# EAGLE design VIA_PAR_Adapter_Low (EAGLE 9.5.2)
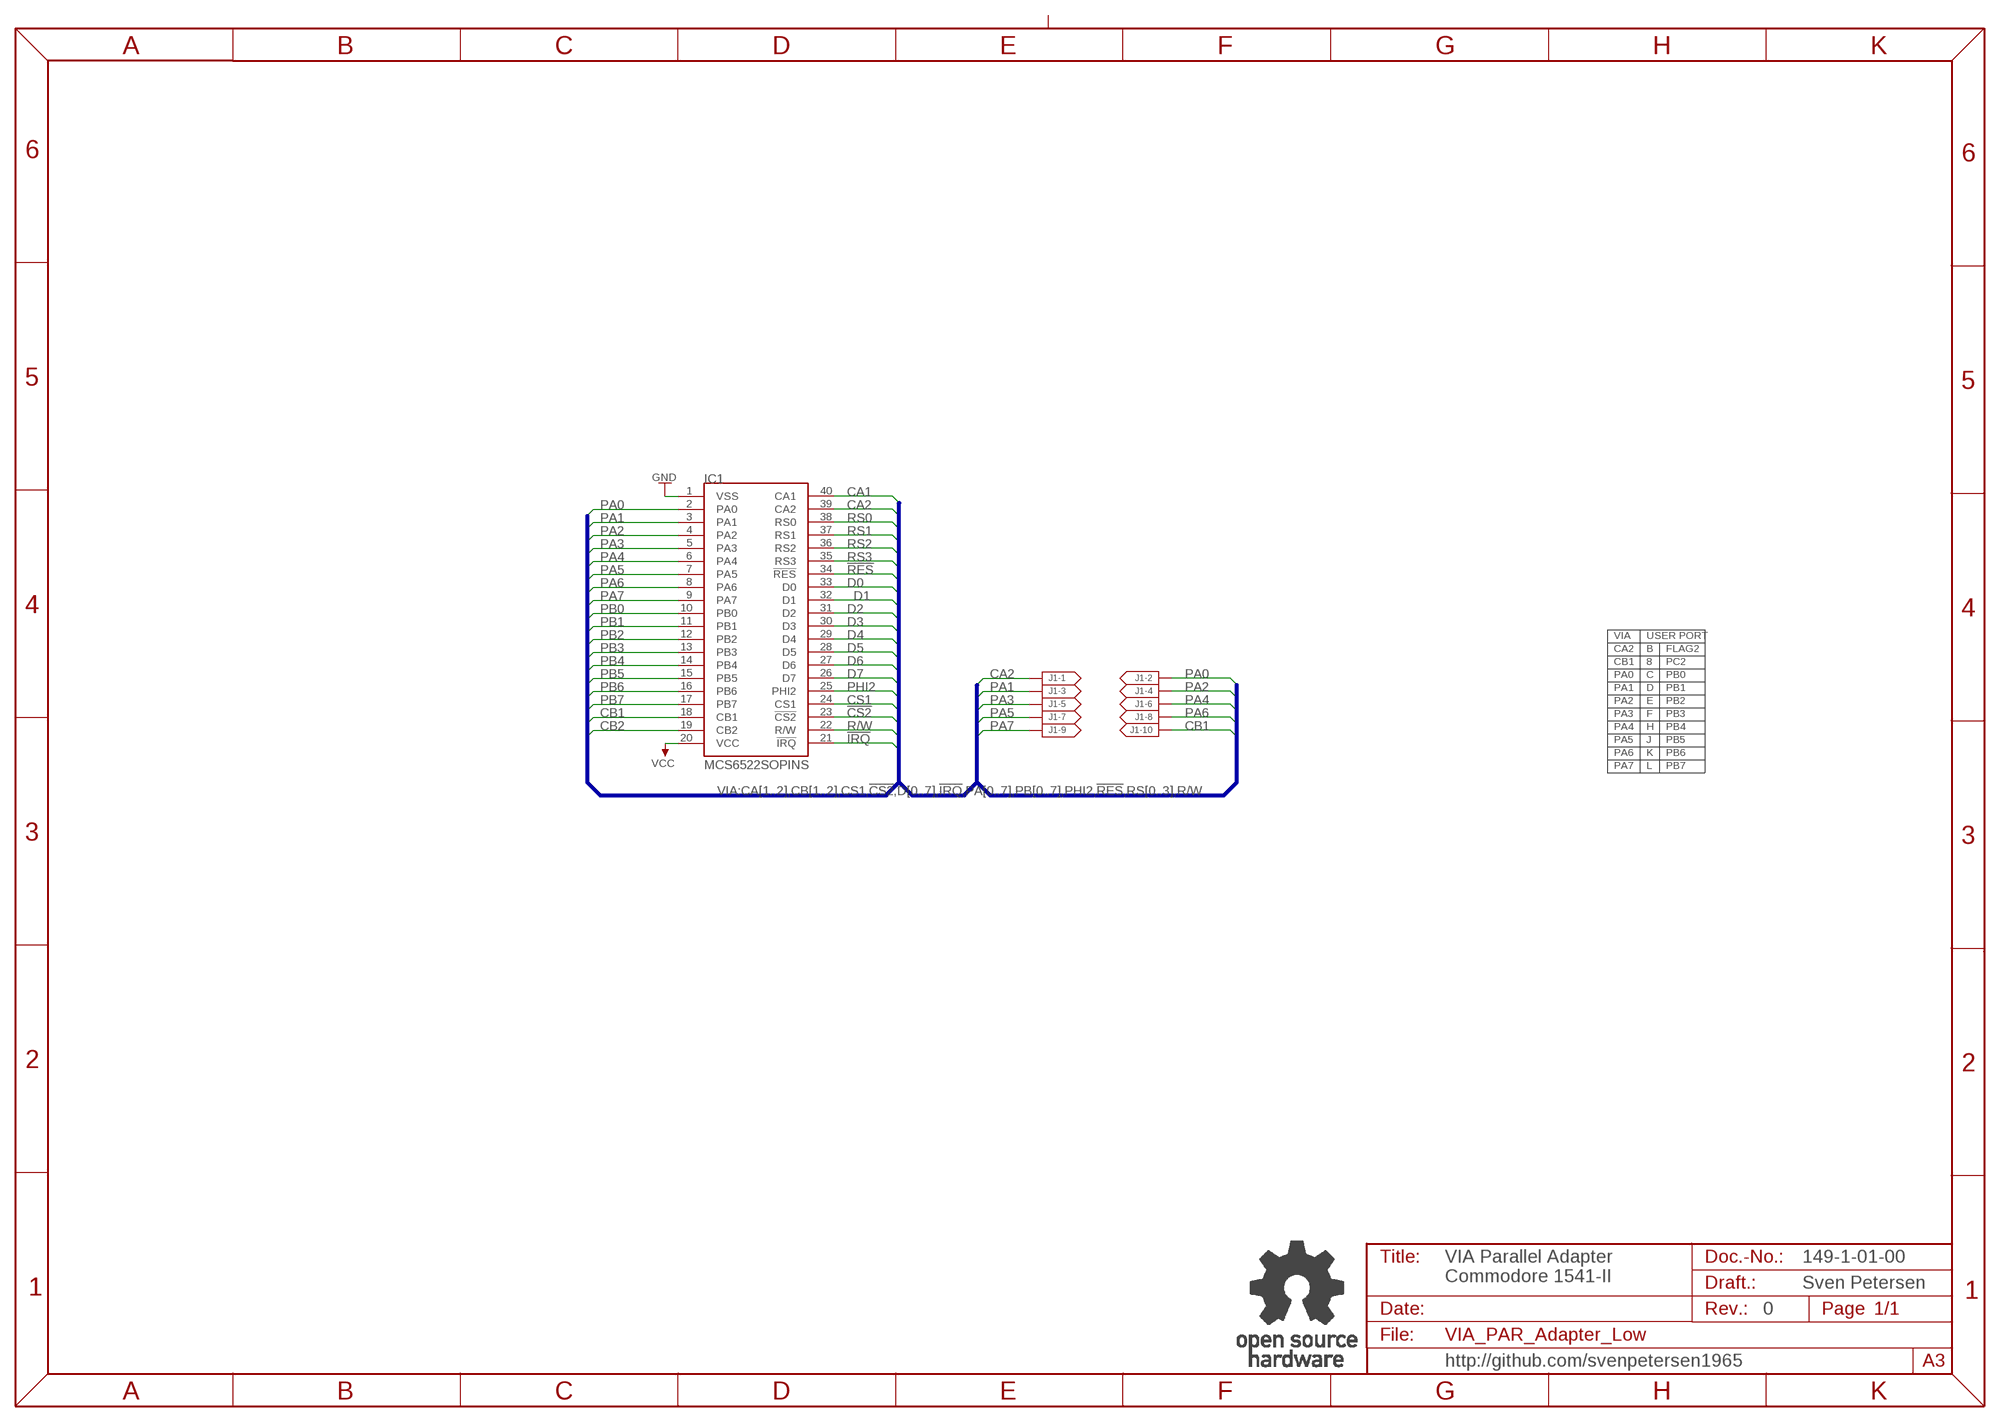
[diagram p0: schematic, sheet 1]

## Parts
IC1  MCS6522SOPINS  [SOCKETPINS40]
J1  MICMA10B-THT  [MICMA10B]
U$5  OPEN_SOURCE_HW  [OPENHW]

## Nets
!CS2: IC1.23(!CS2)
!IRQ: IC1.21(!IRQ)
!RES: IC1.34(!RES)
CA1: IC1.40(CA1)
CA2: IC1.39(CA2) J1.1
CB1: IC1.18(CB1) J1.10
CB2: IC1.19(CB2)
CS1: IC1.24(CS1)
D0: IC1.33(D0)
D1: IC1.32(D1)
D2: IC1.31(D2)
D3: IC1.30(D3)
D4: IC1.29(D4)
D5: IC1.28(D5)
D6: IC1.27(D6)
D7: IC1.26(D7)
GND: IC1.1(VSS)
PA0: IC1.2(PA0) J1.2
PA1: IC1.3(PA1) J1.3
PA2: IC1.4(PA2) J1.4
PA3: IC1.5(PA3) J1.5
PA4: IC1.6(PA4) J1.6
PA5: IC1.7(PA5) J1.7
PA6: IC1.8(PA6) J1.8
PA7: IC1.9(PA7) J1.9
PB0: IC1.10(PB0)
PB1: IC1.11(PB1)
PB2: IC1.12(PB2)
PB3: IC1.13(PB3)
PB4: IC1.14(PB4)
PB5: IC1.15(PB5)
PB6: IC1.16(PB6)
PB7: IC1.17(PB7)
PHI2: IC1.25(PHI2)
R/W: IC1.22(R/W)
RS0: IC1.38(RS0)
RS1: IC1.37(RS1)
RS2: IC1.36(RS2)
RS3: IC1.35(RS3)
VCC: IC1.20(VCC)

## Buses
VIA:CA[1..2],CB[1..2],CS1,!CS2,D[0..7],!IRQ,PA[0..7],PB[0..7],PHI2,!RES,RS[0..3],R/W

## Notes on the sheet
- VIA | USER PORT
- CA2 | B | !FLAG2
- CB1 | 8 | !PC2
- PA0 | C | PB0
- PA1 | D | PB1
- PA2 | E | PB2
- PA3 | F | PB3
- PA4 | H | PB4
- PA5 | J | PB5
- PA6 | K | PB6
- PA7 | L | PB7
- 149-1-01-00
- VIA Parallel Adapter
  Commodore 1541-II
- Sven Petersen
- 0
- http://github.com/svenpetersen1965

## Library data of the parts
IC1 = MOS:MCS6522
J1 = AMP:MICMA10B
U$5 = Logo:OPEN_SOURCE_HW

## Board
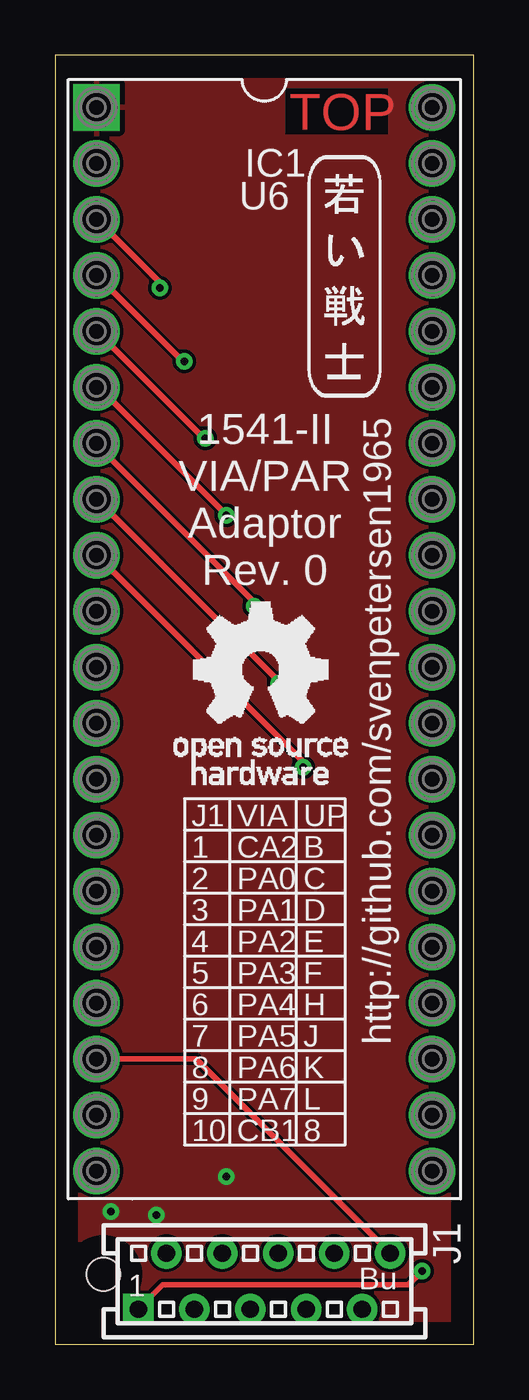
[diagram p1: board, top side]
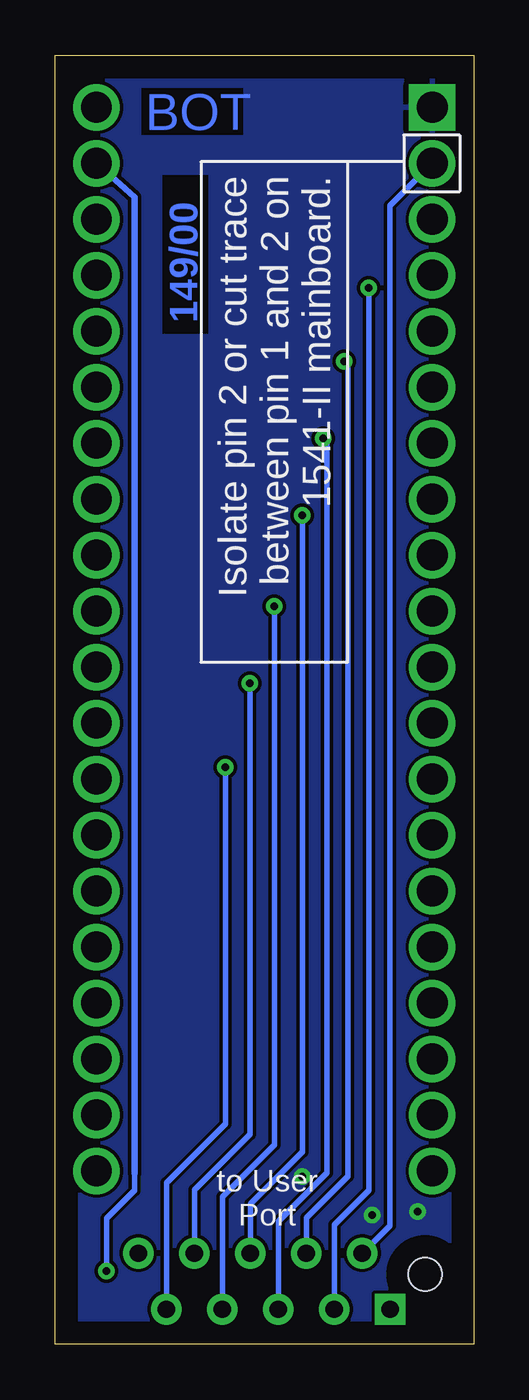
[diagram p2: board, bottom side, seen from below]

Size 19 x 58.5 mm. Coordinates in mm from the lower left corner, seen from the top.
Outline: 0,0 19,0 19,58.5 0,58.5 0,0
Copper layers (1*16): Top 0.035mm / dielectric 1.5mm / Bottom 0.035mm
Design rules "default *": minimum track width 6mil, minimum drill 0.35mm, track to track 6mil, track to pad 6mil, pad to pad 6mil, via to via 6mil, smd to smd 6mil, copper to edge 40mil, drill to drill 6mil, minimum pad ring 10mil, minimum via ring 8mil, stop-mask expansion 4mil, vias tented up to drill 25mil, thermal gap 10mil
bRestrict: 4 lines

### Footprints (pad centres in the part's own frame; a part is rotated, then mirrored left to right if it is on the bottom)
SOCKETPINS40 = drill 1.4 square: 1 -24.13,-7.62 | drill 1.4: 2 -21.59,-7.62; 3 -19.05,-7.62; 4 -16.51,-7.62; 5 -13.97,-7.62; 6 -11.43,-7.62; 7 -8.89,-7.62; 8 -6.35,-7.62; 9 -3.81,-7.62; 10 -1.27,-7.62; 11 1.27,-7.62; 12 3.81,-7.62; 13 6.35,-7.62; 14 8.89,-7.62; 15 11.43,-7.62; 16 13.97,-7.62; 17 16.51,-7.62; 18 19.05,-7.62; 19 21.59,-7.62; 20 24.13,-7.62; 21 24.13,7.62; 22 21.59,7.62; 23 19.05,7.62; 24 16.51,7.62; 25 13.97,7.62; 26 11.43,7.62; 27 8.89,7.62; 28 6.35,7.62; 29 3.81,7.62; 30 1.27,7.62; 31 -1.27,7.62; 32 -3.81,7.62; 33 -6.35,7.62; 34 -8.89,7.62; 35 -11.43,7.62; 36 -13.97,7.62; 37 -16.51,7.62; 38 -19.05,7.62; 39 -21.59,7.62; 40 -24.13,7.62
MICMA10B = drill 0.787 pad 1.397 square: 1 5.715,1.27 | drill 0.787 pad 1.397: 2 4.445,-1.27; 3 3.175,1.27; 4 1.905,-1.27; 5 0.635,1.27; 6 -0.635,-1.27; 7 -1.905,1.27; 8 -3.175,-1.27; 9 -4.445,1.27; 10 -5.715,-1.27 | hole 1.499: 7.303,-0.318

### Placement (x,y rotation side)
IC1  9.5,32 270 top
J1  9.5,2.87 180 top
U$5  5.4,25.4 0 top
U$6  [2LAYER]  10.64,55.08 0 top
U$7  [PCB-TITLE/]  0,68 0 top  (outside the outline)
U$8  [SVEN_TAG]  13.18,48.57 0 top

### Tracks (layer width: path | path; a pad name or v marks a point on that pad's centre or on a via)
CA2  (via drill 0.35)
  Top 0.254: J1.1 4.89,2.7 16.03,2.7 v16.67,3.33
  Bottom 0.254: 15.4,7.77 15.4,6.99 16.67,5.71 v16.67,3.33
  Bottom 0.305: 15.4,7.77 15.4,52.06 IC1.39
CB1
  Top 0.254: J1.10 6.4,12.95 IC1.18
GND  (via drill 0.35)
  other vias: 7.78,7.62 2.54,6.03 4.6,5.87
  pour Top: 0.48,57.94 18.45,57.94 18.45,0.79 0.48,0.79
  pour Bottom: 0.48,57.94 18.45,57.94 18.45,0.79 0.48,0.79
PA0
  Bottom 0.254: J1.2 3.81,5.38 3.81,51.66 IC1.2
PA1  (via drill 0.35)
  Top 0.254: v4.76,47.94 4.76,48.17 IC1.3
  Bottom 0.254: J1.3 6.33,5.42 4.76,6.99 v4.76,47.94
PA2  (via drill 0.35)
  Top 0.254: v5.87,44.61 5.78,44.61 IC1.4
  Bottom 0.254: J1.4 7.59,5.74 5.71,7.62 5.71,44.45 v5.87,44.61
PA3  (via drill 0.35)
  Top 0.254: v6.83,41.12 6.73,41.12 IC1.5
  Bottom 0.254: J1.5 8.87,5.58 6.67,7.78 6.67,40.96 v6.83,41.12
PA4  (via drill 0.35)
  Top 0.254: v7.78,37.62 1.97,43.43 IC1.6
  Bottom 0.254: J1.6 10.13,6.38 7.78,8.73 v7.78,37.62
PA5  (via drill 0.35)
  Top 0.254: v9.05,33.5 9.05,33.66 1.88,40.82 IC1.7
  Bottom 0.254: J1.7 11.4,6.69 9.05,9.05 v9.05,33.5
PA6  (via drill 0.35)
  Top 0.254: v10.16,30 10.16,30.07 IC1.8
  Bottom 0.254: J1.8 12.68,7.01 10.16,9.53 v10.16,30
PA7  (via drill 0.35)
  Top 0.254: v11.27,26.19 11.27,26.42 IC1.9
  Bottom 0.254: J1.9 13.95,7.33 11.27,10 v11.27,26.19

### Text on the board
Bottom: 149/00
tPlace: U6 | http://github.com/svenpetersen1965 | 1541-II / VIA/PAR / Adaptor / Rev. 0 | J1 | VIA | UP | 1 | CA2 | B | 2 | PA0 | C | 3 | PA1 | D | 4 | PA2 | E | 5 | PA3 | F | 6 | PA4 | H | 7 | PA5 | J | 8 | PA6 | K | 9 | PA7 | L | 10 | CB1 | 8
bPlace: Isolate pin 2 or cut trace / between pin 1 and 2 on / 1541-II mainboard. | to User / Port
Document: 149-2-01-00 | Sven Petersen / 2020 | 35µm | 2 | 0